# EAGLE schematic whistlev2 (EAGLE 6.2)
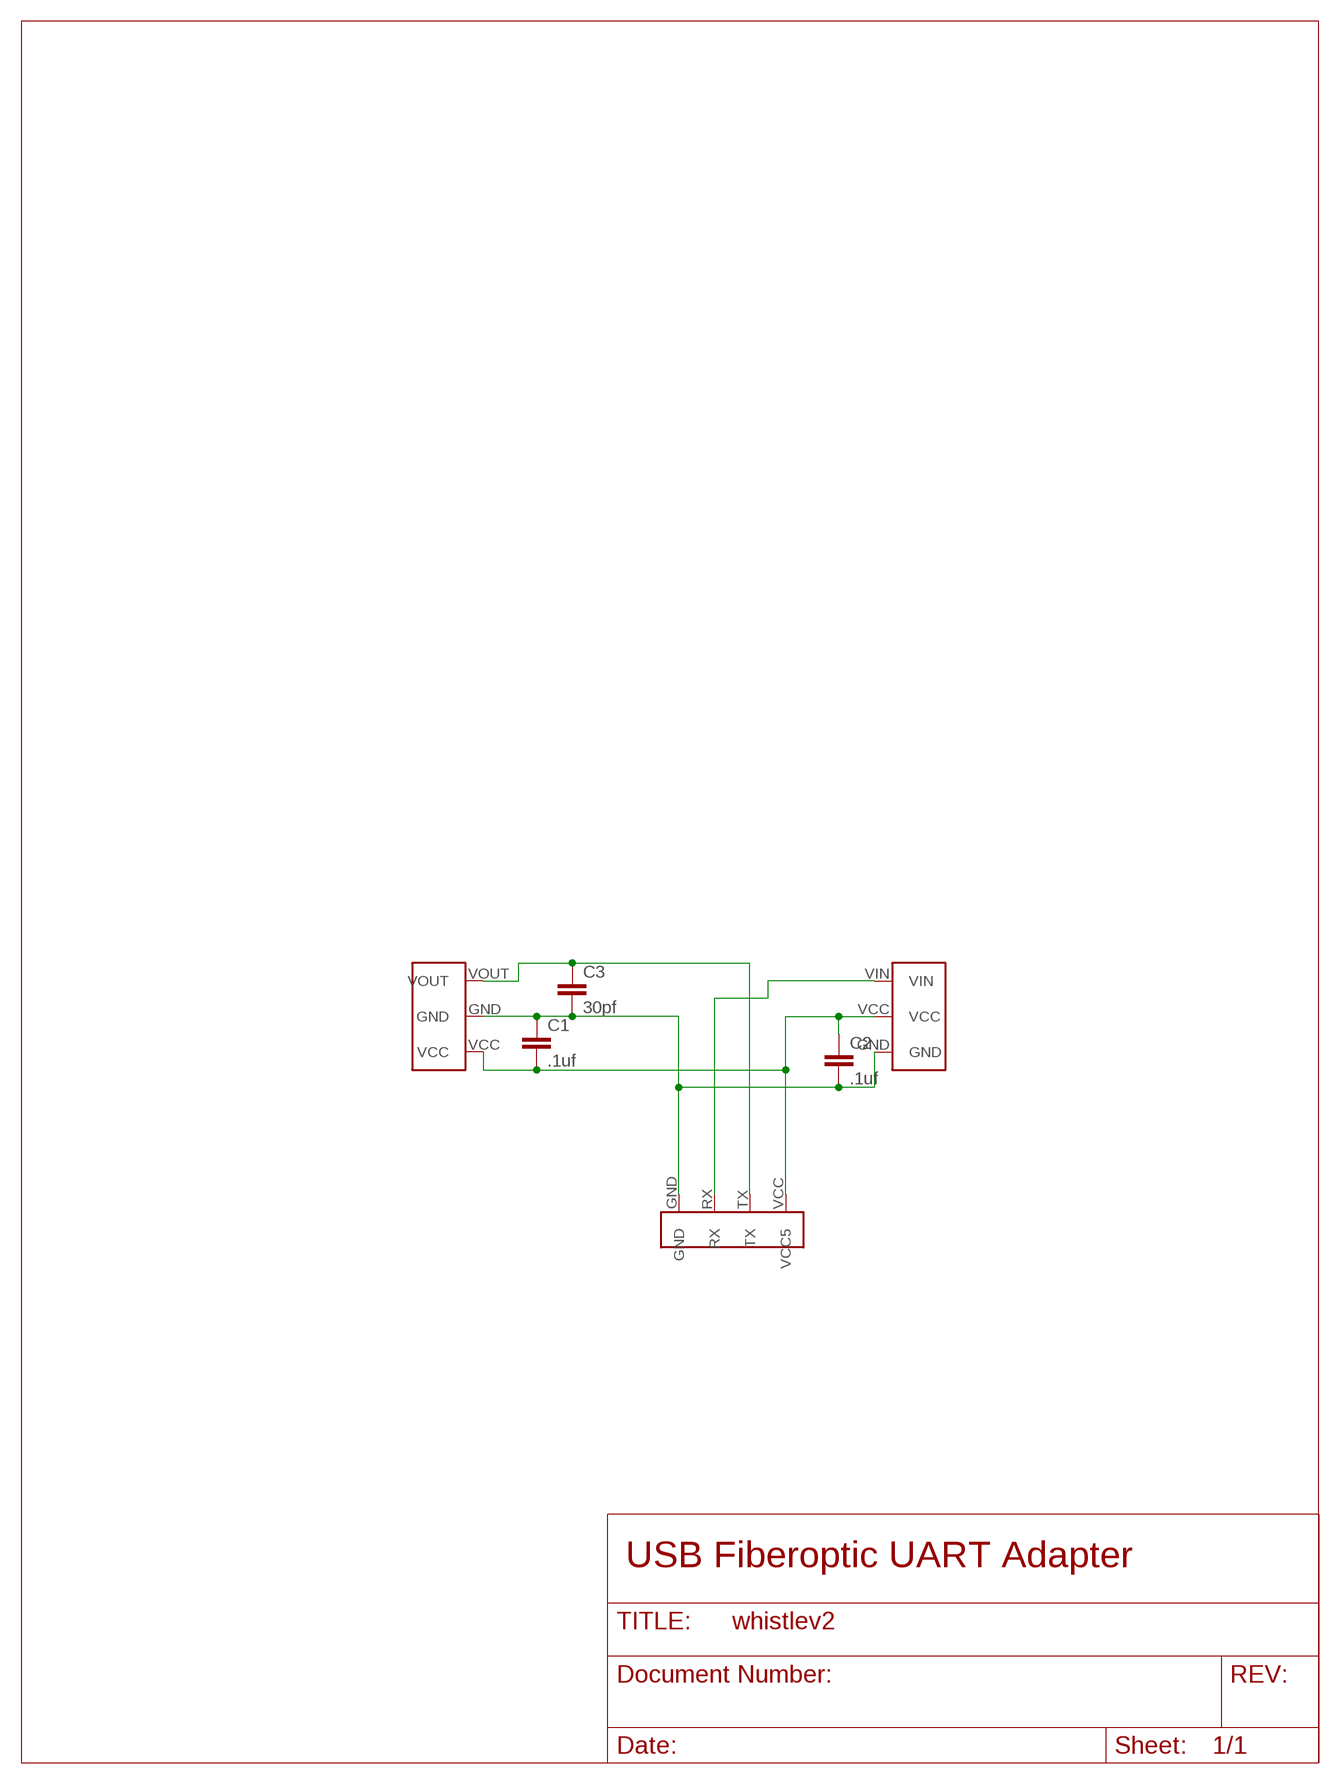
[diagram p0: schematic, sheet 1]

## Parts
C1  .1uf  CAP0805  [0805]
C2  .1uf  CAP0805  [0805]
C3  30pf  CAP0805  [0805]
U$1  DLR1160  [DLR]
U$2  DLT1160  [DLT]
U$3  RS  [RS-232]

## Nets
N$1: C1.2 C2.1 U$1.VCC U$2.VCC U$3.VCC(VCC5)
N$2: C1.1 C2.2 C3.2 U$1.GND U$2.GND U$3.GND
N$4: C3.1 U$1.VOUT U$3.TX
N$5: U$2.VIN U$3.RX

## Notes on the sheet
- USB Fiberoptic UART Adapter

## Library data of the parts
C1-C3 = SparkFun-Passives:CAP: Capacitor Standard 0603 ceramic capacitor, and 0.1" leaded capacitor.
U$1 = TOS:DLR1160
U$2 = TOS:DLT1160
U$3 = TOS:RS